# Altium schematic sheet RX.SchDoc: {Наименование}
size 420 x 297 mm; ApprovedBy: {Утвердил}; CheckedBy: {Проверил}; DrawnBy: {Разраб.}; DocumentNumber: НРДЦ.ХХХХХХ.ХХХ 00; SheetNumber: {}; SheetTotal: {}; Scale: {Мш.}; PageSetup: Record=PageOptions|CenterHorizontal=False|CenterVertical=False|PrintScale=0.95|XCorrection=0.00|YCorrection=0.00|PrintKind=1|BorderSize=5000000|LeftOffset=0|BottomOffset=0|Orientation=1|PaperLength=1000|PaperWidth=1000|Scale=100|PaperSource=15|PrintQuality=600|MediaType=1|DitherType=10|PaperKind=A4|PrintScaleMode=1; ProcessInspection: {Т.контр.}; Mass: {М.}; NormInspection: {Н.контр.}; Letter1Column: {}; Letter2Column: {}; Letter3Column: {}; DocumentType: {Документ}; Rule: PcbType=ProtelPcb
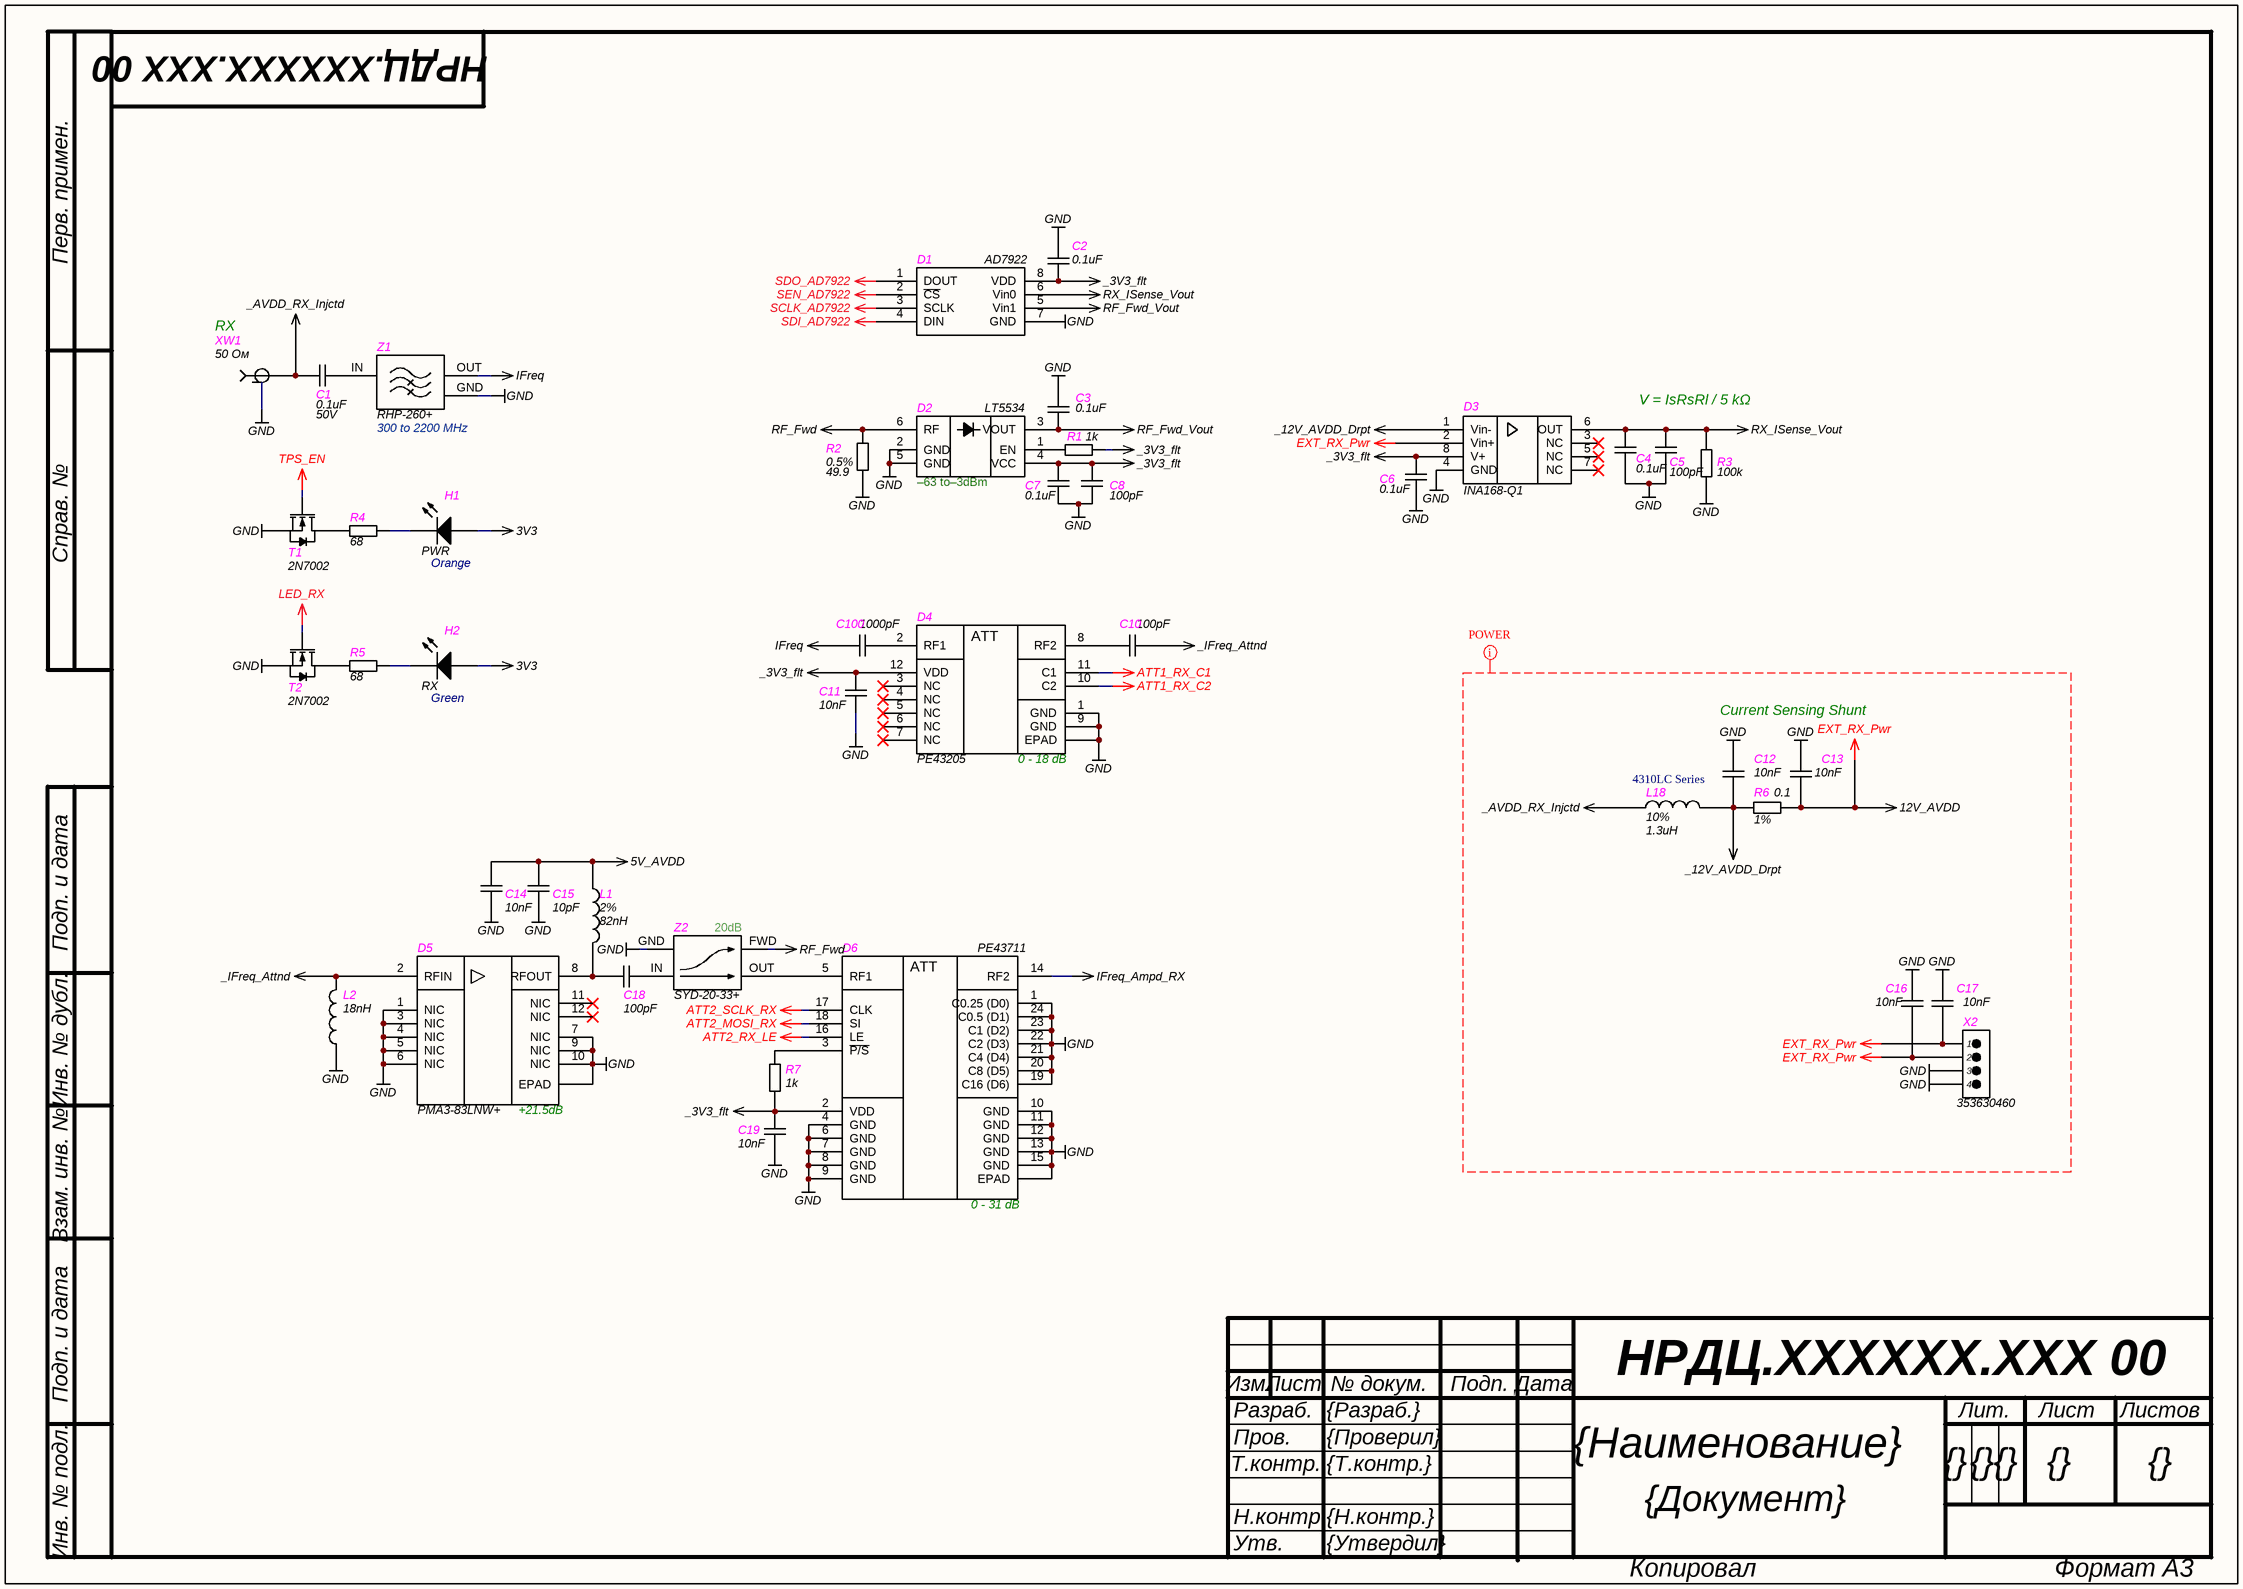
[diagram p0: RX.SchDoc]

## Parts
C1  value 0.1uF  Voltage: 50V  [C1206]  (hidden comment: CAP)
C2  value 0.1uF  [C0402]  (hidden comment: CAP)
C3  value 0.1uF  [C0402]  (hidden comment: CAP)
C4  value 0.1uF  [C0402]  (hidden comment: CAP)
C5  value 100pF  [C0402]  (hidden comment: CAP)
C6  value 0.1uF  [C0402]  (hidden comment: CAP)
C7  value 0.1uF  [C0402]  (hidden comment: CAP)
C8  value 100pF  [C0402]  (hidden comment: CAP)
C10  value 100pF  [C0402]  (hidden comment: CAP)
C11  value 10nF  [C0402]  (hidden comment: CAP)
C12  value 10nF  [C0402]  (hidden comment: CAP)
C13  value 10nF  [C0402]  (hidden comment: CAP)
C14  value 10nF  [C0402]  (hidden comment: CAP)
C15  value 10pF  [C0402]  (hidden comment: CAP)
C16  value 10nF  [C0402]  (hidden comment: CAP)
C17  value 10nF  [C0402]  (hidden comment: CAP)
C18  value 100pF  [C0402]  (hidden comment: CAP)
C19  value 10nF  [C0402]  (hidden comment: CAP)
C100  value 1000pF  [C0402]  (hidden comment: CAP)
D1  AD7922  [MSOP-8]
D2  LT5534  RF Input Power Range: –63 to–3dBm  [SC70]
D3  INA168-Q1  [TSSOP (8)]
D4  PE43205  [QFN-12]
D5  PMA3-83LNW+  [DQ1225]
D6  PE43711  [QFN-24]
H1  PWR  Color: Orange  [LED_0805_Green]
H2  RX  Color: Green  [LED_0805_Green]
L1  value 82nH  Tolerance: 2%  [L0603_HP]  (hidden comment: Inductor RF)
L2  value 18nH  [L0603_HP]  (hidden comment: Inductor RF)
L18  value 1.3uH  Tolerance: 10%  [4310LC]  (hidden comment: Inductor RF)
R1  value 1k  [R0402]  (hidden comment: RES)
R2  value 49.9  Tolerance: 0.5%  [R0402]  (hidden comment: RES)
R3  value 100k  [R0402]  (hidden comment: RES)
R4  value 68  [R0402]  (hidden comment: RES)
R5  value 68  [R0402]  (hidden comment: RES)
R6  value 0.1  Tolerance: 1%  [R0805]  (hidden comment: RES)
R7  value 1k  [R0402]  (hidden comment: RES)
T1  2N7002  [SOT-23]
T2  2N7002  [SOT-23]
X2  353630460  [CON_353630460]
XW1  50 Ом  [MOLEX SD-73251-135 (Gold)]
Z1  RHP-260+  Frequency: 300 to 2200 MHz  [GP731]
Z2  SYD-20-33+  Coupling: 20dB  [AH202]

## Nets
3V3: H1.2(A) H2.2(A)
5V_AVDD: C14.2 C15.2 L1.2
12V_AVDD: C13.1 C16.2 C17.2 D3.2(Vin+) R6.1 X2.1 X2.2  [also labelled EXT_RX_Pwr]
_3V3_flt: C2.1 C6.2 C7.2 C8.2 C11.2 C19.2 D1.8(VDD) D2.4(VCC) D3.8(V+) D4.12(VDD) D6.2(VDD) R1.1 R7.1
_12V_AVDD_Drpt: C12.1 D3.1(Vin-) L18.1 R6.2
_AVDD_RX_Injctd: C1.1 L18.2 XW1.S(RF)
_IFreq_Attnd: C10.2 D5.2(RFIN) L2.2
ATT1_RX_C1: D4.11(C1)
ATT1_RX_C2: D4.10(C2)
ATT2_MOSI_RX: D6.18(SI)
ATT2_RX_LE: D6.16(LE)
ATT2_SCLK_RX: D6.17(CLK)
GND: C2.2 C3.1 C4.1 C5.1 C6.1 C7.1 C8.1 C11.1 C12.2 C13.2 C14.1 C15.1 C16.1 C17.1 C19.1 D1.7(GND) D2.2(GND) D2.5(GND) D3.4(GND) D4.1(GND) D4.9(GND) D4.13(EPAD) D5.1(NIC) D5.3(NIC) D5.4(NIC) D5.5(NIC) D5.6(NIC) D5.7(NIC) D5.9(NIC) D5.10(NIC) D5.13(EPAD) D6.1(C0.25_(D0)) D6.4(GND) D6.6(GND) D6.7(GND) D6.8(GND) D6.9(GND) D6.10(GND) D6.11(GND) D6.12(GND) D6.13(GND) D6.15(GND) D6.19(C16_(D6)) D6.20(C8_(D5)) D6.21(C4_(D4)) D6.22(C2_(D3)) D6.23(C1_(D2)) D6.24(C0.5_(D1)) D6.25(EPAD) L2.1 R2.2 R3.1 T1.2(S) T2.2(S) X2.3 X2.4 XW1.G(GND) Z1.GND Z2.GND
IFreq: C100.1 Z1.OUT
IFreq_Ampd_RX: D6.14(RF2)
LED_RX: T2.1(G)
RF_Fwd: D2.6(RF) R2.1 Z2.FWD
RF_Fwd_Vout: C3.2 D1.5(Vin1) D2.3(VOUT)
RX_ISense_Vout: C4.2 C5.2 D1.6(Vin0) D3.6(OUT) R3.2
SCLK_AD7922: D1.3(SCLK)
SDI_AD7922: D1.4(DIN)
SDO_AD7922: D1.1(DOUT)
SEN_AD7922: D1.2(~{CS})
TPS_EN: T1.1(G)
NetC1_2: C1.2 Z1.IN
NetC10_1: C10.1 D4.8(RF2)
NetC18_1: C18.1 D5.8(RFOUT) L1.1
NetC18_2: C18.2 Z2.IN
NetC100_2: C100.2 D4.2(RF1)
NetD2_1: D2.1(EN) R1.2
NetD6_3: D6.3(~{P/S}) R7.2
NetD6_5: D6.5(RF1) Z2.OUT
NetH1_1: H1.1(K) R4.2
NetH2_1: H2.1(K) R5.1
NetR4_1: R4.1 T1.3(D)
NetR5_2: R5.2 T2.3(D)

Not connected (* = marked no-connect by the designer): D3 3(NC)* 5(NC)* 7(NC)*; D4 3(NC)* 4(NC)* 5(NC)* 6(NC)* 7(NC)*; D5 11(NIC)* 12(NIC)*

## Layout directives
net class POWER: 12V_AVDD, _12V_AVDD_Drpt, _AVDD_RX_Injctd, EXT_RX_Pwr, GND

## Notes on the sheet
- (near XW1) RX
- V = IsRsRl / 5 kΩ
- Current Sensing Shunt
- 4310LC Series
- Перв. примен.
- Справ. №
- Подп. и дата
- Инв. № дубл.
- Взам. инв. №
- Изм.
- Лист
- № докум.
- Подп.
- Дата
- Т.контр.
- Пров.
- Разраб.
- Лит.
- Листов
- Инв. № подл.
- Н.контр.
- Утв.
- Копировал
- Формат А3
- (in symbol PE43205) ATT; 0 - 18 dB
- (in symbol PE43711) ATT; 0 - 31 dB
- (in symbol PMA3-83LNW+) +21.5dB

## Library data of the parts
C1 = CAP: SMD Capacitor; Manufacturer: Murata; Material: NP0; Tolerance: 5%; Type: Ceramic Capacitor; P/N: GRM31C5C1H104JA01K; Supplier 1: Digi-Key; Supplier Part Number 1: 490-8335-1-ND; Supplier 2: Mouser; Supplier Part Number 2: 81-GRM31C5C1H104JA1K; Supplier 3: Farnell; Supplier Part Number 3: *
C2-C4 C6 C7 = CAP: SMD Capacitor; Manufacturer: Murata; Material: X7R; Tolerance: 10%; Voltage: 10V; Type: Ceramic Capacitor; P/N: GRM155R71A104KA01J; Supplier 1: Digi-key; Supplier Part Number 1: 490-6322-1-ND; Supplier 2: Mouser; Supplier Part Number 2: 81-GRM155R71A104KA1J; Supplier 3: Farnell; Supplier Part Number 3: *
C5 C8 C10 C18 = CAP: SMD Capacitor; Manufacturer: Murata; Material: NP0; Tolerance: 1%; Voltage: 50V; Type: Ceramic Capacitor; P/N: GRM1555C1H101FA01D; Supplier 1: Digi-key; Supplier Part Number 1: 490-8180-1-ND; Supplier 2: Mouser; Supplier Part Number 2: 81-GRM1555C1H101FA1D; Supplier 3: Farnell; Supplier Part Number 3: *
C11-C14 C16 C17 C19 = CAP: SMD Capacitor; Manufacturer: Murata; Material: X7R; Tolerance: 10%; Voltage: 25V; Type: Ceramic Capacitor; P/N: GRM155R71E103KA01D; Supplier 1: Digi-key; Supplier Part Number 1: 490-1312-1-ND; Supplier 2: Mouser; Supplier Part Number 2: 81-GRM36X103K25; Supplier 3: Farnell; Supplier Part Number 3: *
C15 = CAP: SMD Capacitor; Manufacturer: Murata; Material: NP0; Tolerance: 1%; Voltage: 50V; Type: Ceramic Capacitor; P/N: GRM1555C1H100FA01D; Supplier 1: Digi-key; Supplier Part Number 1: 490-6186-1-ND; Supplier 2: Mouser; Supplier Part Number 2: 81-GRM1555C1H100FA1D; Supplier 3: Farnell; Supplier Part Number 3: *
C100 = CAP: SMD Capacitor; Manufacturer: Murata; Material: NP0; Tolerance: 5%; Voltage: 50V; Type: Ceramic Capacitor; P/N: GRM1555C1H102JA01D; Supplier 1: Digi-key; Supplier Part Number 1: 490-3244-1-ND; Supplier 2: Mouser; Supplier Part Number 2: 81-GRM1555C1H102JA1D; Supplier 3: Farnell; Supplier Part Number 3: *
D1 = AD79x2: 1 MSPS, 10-/12-Bit ADC; Manufacturer: Analog Device; Fast throughput rate: 1MHz; High speed serial interface: SPI®/QSPI™/MICROWIRE™/DSP compatible; Name: AD7922ARM; Type: 2-Channel, 2.35 V to 5.25 V,1 MSPS, 10-/12-Bit ADC; Voltage: 2.35 V to 5.25 V; P/N: AD7922ARMZ; Package: MSOP-8; Value: AD7922; Supplier 1: Digi-key; Supplier Part Number 1: 505-AD7922ARMZ-ND; Supplier 2: Mouser; Supplier Part Number 2: 584-AD7922ARMZ; Supplier 3: Farnell; Supplier Part Number 3: *
D2 = LT5534: 50MHz to 3GHz monolithic RF power / detector; Manufacturer: Linear Technology; Voltage: Single 2.7V to 5.25V; Impedance: 2kΩ; Frequency Range: 50 to 3000 MHz; Name: LT5534; Package: 6-Lead SC70; Type: RF Power Detector; P/N: LT5534; Supplier 1: Digi-Key; Supplier Part Number 1: LT5534ESC6#TRMPBFCT-ND; Value: LT5534; Supplier 2: Mouser; Supplier Part Number 2: 584-LT5534ESC6TRMPBF; Supplier 3: Farnell; Supplier Part Number 3: 4029917RL
D3 = INA168-Q1: Automotive-Grade, High-Side, Current-Output, Current-Shunt Monitor; Manufacturer: Texas Instruments; Name: INA168Q; Voltage: 2.7 V to 60 V; P/N: INA168QPWRQ1; Voltage Gain: Adjustable; Frequency Range: 800kHz; Package: TSSOP (8); Type: Current-Shunt Monitor; Supplier 1: Digi-Key; Supplier Part Number 1: 296-17201-1-ND; Value: INA168-Q1; Supplier 2: Mouser; Supplier Part Number 2: 595-INA168QPWRQ1; Supplier 3: Farnell; Supplier Part Number 3: *
D4 = PE43205: 50Ω, HaRP™ technology-enhanced / fast switching 2-bit RF Digital Step Attenuator; Manufacturer: Peregrine Technical Solutions; Type: 2-bit, 18 dB; Name: PE43205; P/N: PE43205; Package: Green 12-lead 3x3 mm QFN; Supplier 1: Digi-Key; Supplier Part Number 1: 1046-1114-6-ND; Value: PE43205; Supplier 2: Mouser; Supplier Part Number 2: 81-PE43205B-Z; Supplier 3: Farnell; Supplier Part Number 3: *
D5 = PMA3-83LNW+: PHEMT based wideband, low noise MMIC amplifier; Manufacturer: Mini-Circuits; Type: LNA; Frequency Range: 0.4 to 8.0 GHz; Impedance: 50Ω; Name: PMA3-83LNW+; Package: DQ1225; P/N: PMA3-83LNW+; Value: PMA3-83LNW+; Supplier 1: Digi-Key; Supplier Part Number 1: 3157-PMA3-83LNW+CT-ND; Supplier 2: Mouser; Supplier Part Number 2: 139-PMA3-83LNW; Supplier 3: Farnell; Supplier Part Number 3: *
D6 = PE43711: The PE43711 is a 50Ω, HaRP™ technology-enhanced, 7-bit RF digital step attenuator; Manufacturer: Peregrine Technical Solutions; P/N: PE43711B-Z; Type: 7-bit RF digital step attenuator (DSA); Name: PE43711; Package: 24-lead 4 × 4 × 0.85 mm QFN; Supplier 1: Digi-Key; Supplier Part Number 1: 1046-1138-1-ND; Value: PE43711; Supplier 2: Mouser; Supplier Part Number 2: 81-PE43711B-Z; Supplier 3: Farnell; Supplier Part Number 3: *
H1 = LED: CHIP LED LAMP; Manufacturer: Kingbright; Name: APHCM2012; P/N: APHCM2012SECK-F01; Package: 2.0 x 1.25 mm SMD; Type: CHIP LED LAMP; Supplier 1: Digi-key; Supplier Part Number 1: 754-1096-1-ND; Supplier 2: Mouser; Supplier Part Number 2: 604-APHCM2012SECK; Supplier 3: Farnell; Supplier Part Number 3: *
H2 = LED: CHIP LED LAMP; Manufacturer: Kingbright; Name: APHCM2012; P/N: APHCM2012CGCK-F01; Package: 2.0 x 1.25 mm SMD; Type: CHIP LED LAMP; Supplier 1: Digi-Key; Supplier Part Number 1: 754-1094-1-ND; Supplier 2: Mouser; Supplier Part Number 2: 604-APHCM2012CGCK; Supplier 3: Farnell; Supplier Part Number 3: *
L1 = Inductor RF: Chip SMD Inductor; Manufacturer: Coilcraft; Current: 510mA; Frequency: 1.8GHz; Name: 0603HP-82NXGL; Series: 0603HP; Temperature Range: -25…85°C; P/N: 0603HP-82NXGL; Supplier 1: Digi-key; Supplier Part Number 1: *; Supplier 2: Mouser; Supplier Part Number 2: 994-0603HP-82NXGLW; Supplier 3: Farnell; Supplier Part Number 3: 2286167
L2 = Inductor RF: Chip SMD Inductor; Manufacturer: Coilcraft; Current: 1200mA; Frequency: 3.30GHz; Name: 0603HP-18NXG; Tolerance: 2%; P/N: 0603HP-18NXGRW; Series: 0603HP; Temperature Range: -25…85°C; Supplier 1: Digi-key; Supplier Part Number 1: *; Supplier 2: Mouser; Supplier Part Number 2: 994-0603HP-18NXGRW; Supplier 3: Farnell; Supplier Part Number 3: 2286149
L18 = Inductor RF: Chip SMD Inductor; Manufacturer: Coilcraft; Current: 2.7A; Frequency: 235MHz; Name: 4310LC-132KE_; Series: 4310LC; Temperature Range: -40…85°C; P/N: 4310LC-132KE_; Supplier 1: Digi-key; Supplier Part Number 1: *; Supplier 2: Mouser; Supplier Part Number 2: 994-4310LC-132KEC; Supplier 3: Farnell; Supplier Part Number 3: *
R1 R7 = RES: SMD Resistor; Name: Chip SMD Resistor; Power: 0.062 Wt; Tolerance: 5%; P/N: ERJ-2GEJ102X; Temperature Range: -55…155°C; Supplier 1: Digi-key; Supplier Part Number 1: P1.0KJCT-ND; Supplier 2: Mouser; Supplier Part Number 2: 667-ERJ-2GEJ102X; Supplier 3: Farnell; Supplier Part Number 3: *
R2 = RES: SMD Resistor; Manufacturer: Panasonic Electronic Components; Name: Chip SMD Resistor; Power: 0.063 Wt; P/N: ERJ-2RKD49R9X; Temperature Range: -55…155°C; Supplier 1: Digi-key; Supplier Part Number 1: P15987CT-ND; Supplier 2: Mouser; Supplier Part Number 2: 667-ERJ-2RKD49R9X; Supplier 3: Farnell; Supplier Part Number 3: *
R3 = RES: SMD Resistor; Manufacturer: Panasonic Electronic Components; Name: Chip SMD Resistor; Power: 1/5 Wt; Tolerance: 1%; P/N: ERJ-PA2F1003X; Temperature Range: -55…155°C; Supplier 1: Digi-key; Supplier Part Number 1: P17236CT-ND; Supplier 2: Mouser; Supplier Part Number 2: 667-ERJ-PA2F1003X; Supplier 3: Farnell; Supplier Part Number 3: *
R4 R5 = RES: SMD Resistor; Name: Chip SMD Resistor; Power: 0.062 Wt; Tolerance: 5%; P/N: ERJ-2GEJ680X; Temperature Range: -55…155°C; Supplier 1: Digi-key; Supplier Part Number 1: P68JCT-ND; Supplier 2: Mouser; Supplier Part Number 2: 667-ERJ-2GEJ680X; Supplier 3: Farnell; Supplier Part Number 3: *
R6 = RES: SMD Resistor; Manufacturer: Panasonic Electronic Components; Name: Chip SMD Resistor; Power: 1/2 Wt; P/N: ERJ-6DSFR10V; Temperature Range: -55…155°C; Supplier 1: Digi-key; Supplier Part Number 1: P19308CT-ND; Supplier 2: Mouser; Supplier Part Number 2: 667-ERJ-6DSFR10V; Supplier 3: Farnell; Supplier Part Number 3: *
T1 T2 = 2N7002: N-Channel MOSFET 2N7002; Channel Resistance: 5Ohm; Current: 300mA; Power Dissipation: 0.83W; Voltage: 60V; P/N: 2N7002NXAKR; Name: 2N7002; Type: SOT-23; Package: SOT-23; Value: 2N7002; Supplier 1: Digi-key; Supplier Part Number 1: 1727-8643-1-ND; Supplier 2: Mouser; Supplier Part Number 2: 771-2N7002NXAKR; Supplier 3: Farnell; Supplier Part Number 3: *
X2 = 353630460: 2.00mm Pitch Sherlock Wire-to-Board Header, Right-Angle, with Positive Lock, 4 Circuits; Manufacturer: Molex; Mate-with P/N: 355070400; Mate-with Series: 35507; P/N: 353630460; Type: 2.00mm Pitch Sherlock Wire-to-Board Header, Right-Angle; Series: 35363; Pitch: 2.00mm; Name: 353630460; Supplier 1: Digi-Key; Supplier Part Number 1: WM18933-ND; Value: 353630460; Supplier 2: Mouser; Supplier Part Number 2: 538-35363-0460; Supplier 3: Farnell; Supplier Part Number 3: *
XW1 = RF Connector: 50 Ohms, SMA Jack, Vertica; Manufacturer: Molex; Impedance: 50Ω; P/N: 0732511352; Name: SMA Jack; Type: 50 Ohms, SMA Jack, Vertical, PCB SMT, Gold (Au) Body; Supplier 1: Digi-Key; Supplier Part Number 1: WM9458-ND; Supplier 2: Mouser; Supplier Part Number 2: 538-73251-1352; Supplier 3: Farnell; Supplier Part Number 3: *
Z1 = RHP-260+: High Pass Filter; Manufacturer: Mini-Circuits; Impedance: 50Ω; Name: RHP-260+; P/N: RHP-260+; Type: High Pass Filter; Package: GP731; Value: RHP-260+; Supplier 1: Digi-key; Supplier Part Number 1: 3157-RHP-260+CT-ND; Supplier 2: Mouser; Supplier Part Number 2: 139-RHP-260; Supplier 3: Farnell; Supplier Part Number 3: *
Z2 = SYD-20-33+: Directional Coupler; Manufacturer: Mini-Circuits; Impedance: 50Ω; Frequency: 30 to 3000 MHz; Name: SYD-20-33+; P/N: SYD-20-33+; Type: Directional Coupler; Package: AH202; Value: SYD-20-33+; Supplier 1: Digi-key; Supplier Part Number 1: 3157-SYD-20-33+CT-ND; Supplier 2: Mouser; Supplier Part Number 2: 139-SYD-20-33; Supplier 3: Farnell; Supplier Part Number 3: *